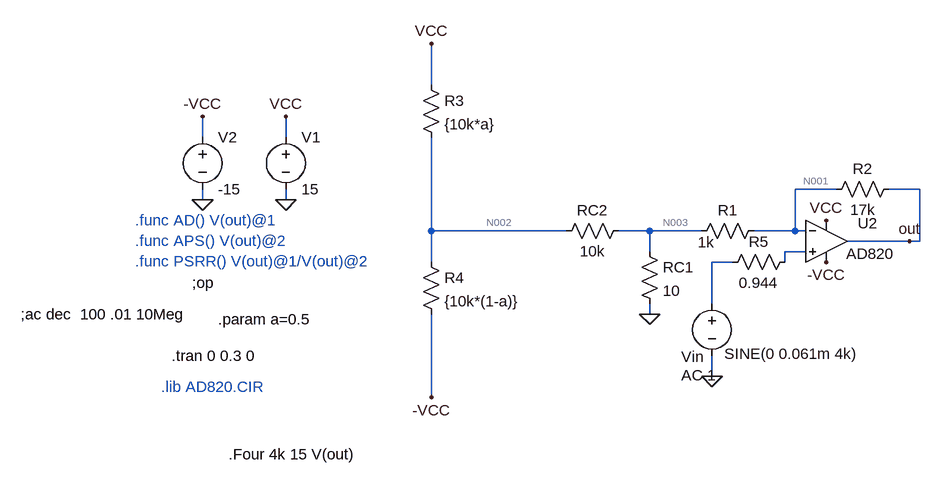
[diagram p0: schematic AO_Neinversor.asc]
AO_Neinversor.asc, the LTspice schematic file:
Version 4
SHEET 1 1512 680
WIRE -256 -48 -256 -112
WIRE -608 32 -608 0
WIRE -480 32 -480 0
WIRE 368 112 304 112
WIRE 496 112 448 112
WIRE -608 128 -608 112
WIRE -480 128 -480 112
WIRE -256 176 -256 32
WIRE -48 176 -256 176
WIRE 80 176 32 176
WIRE 160 176 80 176
WIRE 304 176 304 112
WIRE 304 176 240 176
WIRE 320 176 304 176
WIRE 480 192 384 192
WIRE 496 192 496 112
WIRE 496 192 480 192
WIRE 80 208 80 176
WIRE 320 208 288 208
WIRE -256 224 -256 176
WIRE 208 224 176 224
WIRE 288 224 288 208
WIRE 176 288 176 224
WIRE 80 304 80 288
WIRE 176 400 176 368
WIRE -256 432 -256 304
FLAG 80 304 0
FLAG 176 400 0
FLAG 352 160 VCC
FLAG 352 224 -VCC
FLAG -256 432 -VCC
FLAG -480 0 VCC
FLAG -608 0 -VCC
FLAG 480 192 out
FLAG -480 128 0
FLAG -608 128 0
FLAG -256 -112 VCC
DATAFLAG 496 112 ""
DATAFLAG -176 176 ""
DATAFLAG 496 192 ""
SYMBOL res 48 160 R90
WINDOW 0 0 56 VBottom 2
WINDOW 3 32 56 VTop 2
SYMATTR InstName RC2
SYMATTR Value 10k
SYMBOL res 64 192 R0
SYMATTR InstName RC1
SYMATTR Value 10
SYMBOL res 256 160 R90
WINDOW 0 0 56 VBottom 2
WINDOW 3 18 89 VTop 2
SYMATTR InstName R1
SYMATTR Value 1k
SYMBOL res 464 96 R90
WINDOW 0 0 56 VBottom 2
WINDOW 3 32 56 VTop 2
SYMATTR InstName R2
SYMATTR Value 17k
SYMBOL voltage 176 272 R0
WINDOW 123 -47 126 Left 2
WINDOW 39 0 0 Left 0
WINDOW 3 19 93 Left 2
WINDOW 0 -47 98 Left 2
SYMATTR Value2 AC 1
SYMATTR Value SINE(0 0.061m 4k)
SYMATTR InstName Vin
SYMBOL voltage -480 16 R0
WINDOW 123 0 0 Left 0
WINDOW 39 0 0 Left 0
SYMATTR InstName V1
SYMATTR Value 15
SYMBOL voltage -608 16 R0
WINDOW 123 0 0 Left 0
WINDOW 39 0 0 Left 0
SYMATTR InstName V2
SYMATTR Value -15
SYMBOL OpAmps\\AD820 352 128 R0
WINDOW 0 48 36 Left 2
WINDOW 3 31 83 Left 2
SYMATTR InstName U2
SYMBOL res -272 -64 R0
SYMATTR InstName R3
SYMATTR Value {10k*a}
SYMBOL res -272 208 R0
SYMATTR InstName R4
SYMATTR Value {10k*(1-a)}
SYMBOL res 304 208 R90
WINDOW 0 0 56 VBottom 2
WINDOW 3 32 56 VTop 2
SYMATTR InstName R5
SYMATTR Value 0.944
TEXT -624 256 Left 2 !;op
TEXT -584 312 Left 2 !.param a=0.5
TEXT -712 160 Left 2 ;.func AD() V(out)@1\n.func APS() V(out)@2\n.func PSRR() V(out)@1/V(out)@2
TEXT -888 304 Left 2 !;ac dec  100 .01 10Meg
TEXT -672 416 Left 2 ;.lib AD820.CIR
TEXT -656 368 Left 2 !.tran 0 0.3 0
TEXT -568 520 Left 2 !.Four 4k 15 V(out)

The netlist it stands for:
* AO_Neinversor.asc
RC2 N003 N002 10k
RC1 N003 0 10
R1 N001 N003 1k
R2 out N001 17k
Vin N005 0 SINE(0 0.061m 4k) AC 1
V1 VCC 0 15
V2 -VCC 0 -15
XU2 N004 N001 VCC -VCC out AD820  ; pins In+ In- V+ V- OUT
R3 VCC N002 {10k*a}
R4 N002 -VCC {10k*(1-a)}
R5 N004 N005 0.944
;op
.param a=0.5
* .func AD() V(out)@1
* .func APS() V(out)@2
* .func PSRR() V(out)@1/V(out)@2
;ac dec  100 .01 10Meg
* .lib AD820.CIR
.tran 0 0.3 0
.Four 4k 15 V(out)
.backanno
.end

* Results of the author's LTspice run, read from the files saved beside the schematic
* Operating Point, zero values left out:
*   V(out) = 33.97 nV
*   V(vcc) = 15 V
*   V(-vcc) = -15 V
*   I(R2) = 1.998 pA
*   I(R3) = 3 mA
*   I(R4) = 3 mA
*   I(R5) = -2 pA
*   I(Vin) = -2 pA
*   I(V1) = -3.707 mA
*   I(V2) = 3.707 mA
*   Ix(u2:1) = 2 pA
*   Ix(u2:2) = 2 pA
*   Ix(u2:3) = 707.5 µA
*   Ix(u2:4) = -707.5 µA
*   Ix(u2:5) = -1.998 pA
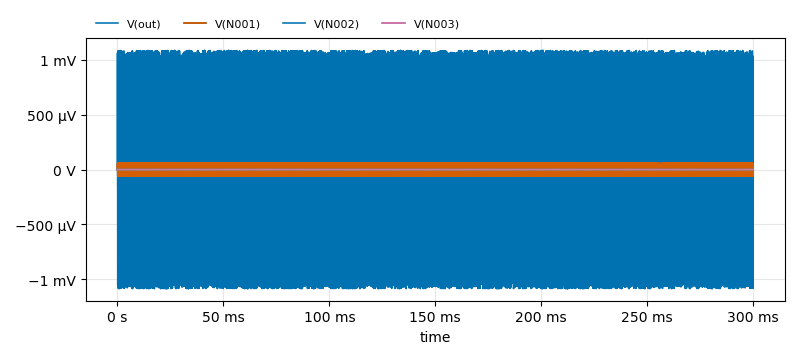
[diagram p1: Transient Analysis of AO_Neinversor.asc, plotted from the saved traces]
* Transient Analysis, 1 run:
*   V(out): min -1.086 mV, max 1.086 mV, average 11.71 nV, rms 778 µV, last -38.16 µV
*   V(N001): min -60.88 µV, max 60.89 µV, average -1.249 nV, rms 43.63 µV, last -2.144 µV
*   V(N002): min -120.5 nV, max 120.5 nV, average -2.472 pV, rms 86.32 nV, last -4.242 nV
*   V(N003): min -602.3 nV, max 602.4 nV, average -12.36 pV, rms 431.6 nV, last -21.21 nV
* From the log:
*   N-Period=1
*   Fourier components of V(out)
*   DC component:6.75866e-07
*   Harmonic  Frequency   Fourier   Normalized   Phase    Normalized
*    Number     [Hz]     Component   Component  [degree]  Phase [deg]
*       1      4.000e+3   1.071e-3   1.000e+0     92.34°      0.00°
*       2      8.000e+3   2.107e-6   1.966e-3     73.50°    -18.84°
*       3      1.200e+4   1.096e-5   1.023e-2    -80.38°   -172.72°
*       4      1.600e+4   9.505e-7   8.872e-4   -175.75°   -268.09°
*       5      2.000e+4   3.403e-6   3.177e-3    -38.66°   -131.00°
*       6      2.400e+4   7.372e-7   6.881e-4   -107.62°   -199.96°
*       7      2.800e+4   1.034e-6   9.648e-4     34.07°    -58.27°
*       8      3.200e+4   7.125e-7   6.651e-4     52.02°    -40.32°
*       9      3.600e+4   5.292e-7   4.940e-4     84.88°     -7.46°
*      10      4.000e+4   3.564e-7   3.327e-4   -158.37°   -250.71°
*      11      4.400e+4   3.906e-7   3.646e-4    148.93°     56.59°
*      12      4.800e+4   1.163e-6   1.085e-3    -71.14°   -163.48°
*      13      5.200e+4   2.813e-7   2.626e-4    -96.46°   -188.80°
*      14      5.600e+4   6.687e-7   6.242e-4      7.69°    -84.65°
*      15      6.000e+4   1.789e-7   1.670e-4    -34.37°   -126.71°
*   Partial Harmonic Distortion: 1.110494%
*   Total Harmonic Distortion:   1.135848%